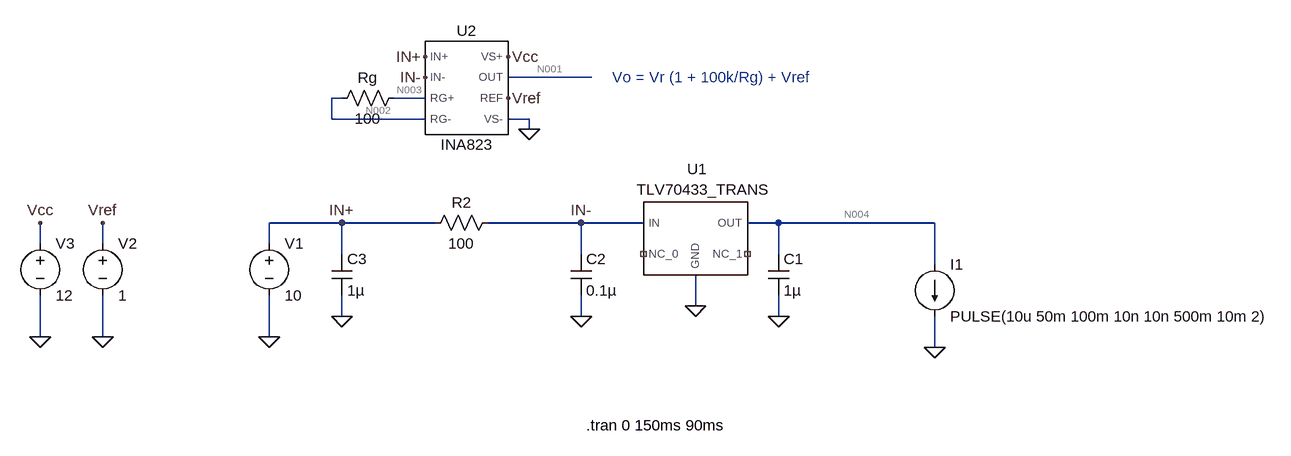
[diagram p0: schematic Draft1.asc]
Draft1.asc, the LTspice schematic file:
Version 4
SHEET 1 1272 680
WIRE 80 -128 -48 -128
WIRE -304 -96 -320 -96
WIRE -176 -96 -224 -96
WIRE -320 -64 -320 -96
WIRE -176 -64 -320 -64
WIRE -16 -64 -48 -64
WIRE -16 -48 -16 -64
WIRE -304 96 -416 96
WIRE -160 96 -304 96
WIRE 64 96 -80 96
WIRE 160 96 64 96
WIRE 368 96 320 96
WIRE 608 96 368 96
WIRE -768 128 -768 96
WIRE -672 128 -672 96
WIRE -416 128 -416 96
WIRE -304 144 -304 96
WIRE 64 144 64 96
WIRE 368 144 368 96
WIRE 608 160 608 96
WIRE 240 224 240 176
WIRE -304 240 -304 208
WIRE 64 240 64 208
WIRE 368 240 368 208
WIRE -768 272 -768 208
WIRE -672 272 -672 208
WIRE -416 272 -416 208
WIRE 608 288 608 240
FLAG -416 272 0
FLAG 608 288 0
FLAG 64 240 0
FLAG 368 240 0
FLAG 240 224 0
FLAG -304 240 0
FLAG -672 272 0
FLAG -672 96 Vref
FLAG -176 -128 IN-
FLAG -176 -160 IN+
FLAG -768 272 0
FLAG -768 96 Vcc
FLAG -304 96 IN+
FLAG 64 96 IN-
FLAG -16 -48 0
FLAG -48 -160 Vcc
FLAG -48 -96 Vref
SYMBOL voltage -416 112 R0
WINDOW 123 0 0 Left 0
WINDOW 39 0 0 Left 0
SYMATTR InstName V1
SYMATTR Value 10
SYMBOL res -64 80 R90
WINDOW 0 0 56 VBottom 2
WINDOW 3 32 56 VTop 2
SYMATTR InstName R2
SYMATTR Value 100
SYMBOL cap 352 144 R0
SYMATTR InstName C1
SYMATTR Value 1µ
SYMBOL cap 48 144 R0
SYMATTR InstName C2
SYMATTR Value 0.1µ
SYMBOL current 608 160 R0
WINDOW 123 0 0 Left 0
WINDOW 39 0 0 Left 0
SYMATTR InstName I1
SYMATTR Value PULSE(10u 50m 100m 10n 10n 500m 10m 2)
SYMBOL TLV70433_TRANS 240 112 R0
SYMATTR InstName U1
SYMBOL cap -320 144 R0
SYMATTR InstName C3
SYMATTR Value 1µ
SYMBOL voltage -672 112 R0
WINDOW 123 0 0 Left 0
WINDOW 39 0 0 Left 0
SYMATTR InstName V2
SYMATTR Value 1
SYMBOL voltage -768 112 R0
WINDOW 123 0 0 Left 0
WINDOW 39 0 0 Left 0
SYMATTR InstName V3
SYMATTR Value 12
SYMBOL res -208 -112 R90
WINDOW 0 0 56 VBottom 2
WINDOW 3 32 56 VTop 2
SYMATTR InstName Rg
SYMATTR Value 100
SYMBOL INA823 -112 -112 R0
SYMATTR InstName U2
TEXT 72 408 Left 2 !.tran 0 150ms 90ms
TEXT 112 -128 Left 2 ;Vo = Vr (1 + 100k/Rg) + Vref

The netlist it stands for:
* Draft1.asc
V1 IN+ 0 10
R2 IN- IN+ 100
C1 N004 0 1µ
C2 IN- 0 0.1µ
I1 N004 0 PULSE(10u 50m 100m 10n 10n 500m 10m 2)
XU1 IN- NC_01 NC_02 N004 0 TLV70433_TRANS  ; pins IN NC_0 NC_1 OUT GND
C3 IN+ 0 1µ
V2 Vref 0 1
V3 Vcc 0 12
Rg N003 N002 100
XU2 IN+ IN- N001 Vref N003 N002 Vcc 0 INA823  ; pins IN+ IN- OUT REF RG+ RG- VS+ VS-
.tran 0 150ms 90ms
* Vo = Vr (1 + 100k/Rg) + Vref
.lib D:\Users\javi_\GitHub\Microwatt_Board\Simu_Microwatt_Board\TLV70433_TRANS.LIB
.lib D:\Users\javi_\GitHub\Microwatt_Board\Simu_Microwatt_Board\ina823.lib
.backanno
.end

* Results of the author's LTspice run, read from the files saved beside the schematic
* Operating Point, zero values left out:
*   V(in+) = 10 V
*   V(in-) = 9.999 V
*   V(n004) = 3.304 V
*   V(vref) = 1 V
*   V(vcc) = 12 V
*   V(n003) = 9.344 V
*   V(n002) = 9.343 V
*   V(n001) = 2.234 V
*   I(I1) = 10 µA
*   I(Rg) = 12.33 µA
*   I(R2) = -12.13 µA
*   I(V3) = -232.6 µA
*   I(V2) = 20 pA
*   I(V1) = -12.13 µA
*   Ix(u1:IN) = 12.13 µA
*   Ix(u1:OUT) = -10 µA
*   Ix(u1:GND) = -1.462 µA
*   Ix(u2:IN+) = 2.76 nA
*   Ix(u2:IN-) = 1.959 nA
*   Ix(u2:REF) = -20 pA
*   Ix(u2:RG+) = -12.33 µA
*   Ix(u2:RG-) = 12.33 µA
*   Ix(u2:VS+) = 232.6 µA
*   Ix(u2:VS-) = -244.9 µA
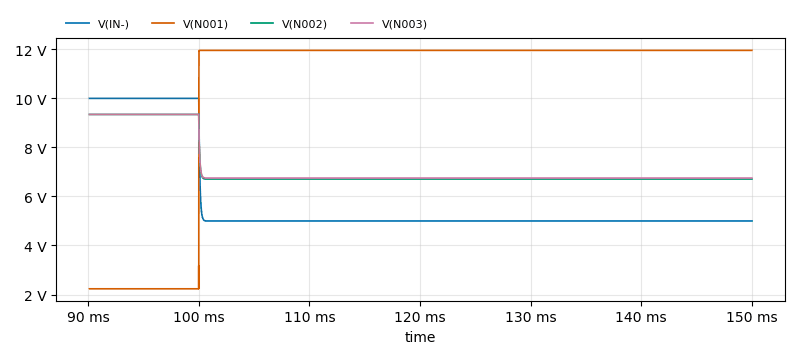
[diagram p1: Transient Analysis of Draft1.asc, plotted from the saved traces]
* Transient Analysis, 1 run:
*   V(IN-): min 5 V, max 9.999 V, average 5.833 V, rms 6.121 V, last 5 V
*   V(N001): min 2.234 V, max 11.96 V, average 10.35 V, rms 10.96 V, last 11.96 V
*   V(N002): min 6.708 V, max 9.343 V, average 7.147 V, rms 7.214 V, last 6.709 V
*   V(N003): min 6.751 V, max 9.344 V, average 7.182 V, rms 7.247 V, last 6.751 V